# EAGLE design Buck scetch (EAGLE 9.3.2)
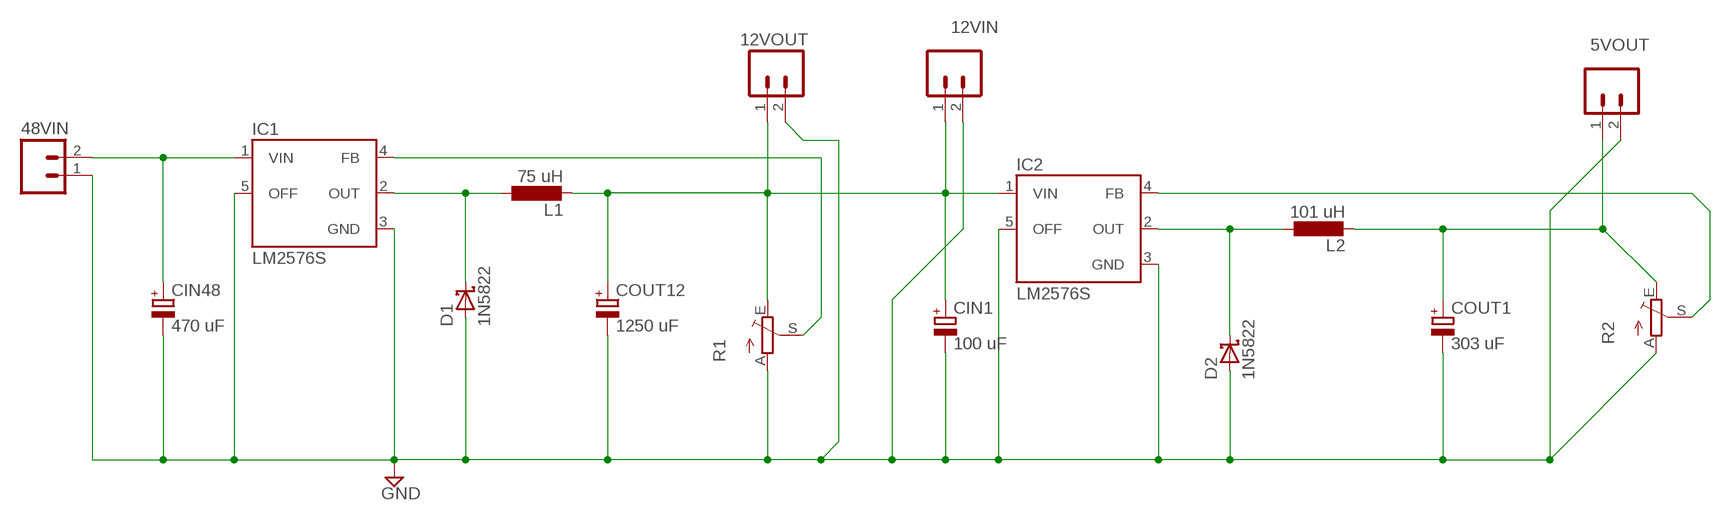
[diagram p0: schematic, sheet 1]

## Parts
5VOUT  M02  [02P]
12VIN  M02  [02P]
12VOUT  M02  [02P]
48VIN  M02  [02P]
CIN1  100 uF  CPOL-EU140CLH-0810  [140CLH-0810]
CIN48  470 uF  CPOL-EU140CLH-0810  [140CLH-0810]
COUT1  303 uF  CPOL-EU140CLH-0810  [140CLH-0810]
COUT12  1250 uF  CPOL-EU140CLH-0810  [140CLH-0810]
D1  1N5822  [DIOAD2120W130L950D530P]
D2  1N5822  [DIOAD2120W130L950D530P]
IC1  LM2576S  [TO263-5]
IC2  LM2576S  [TO263-5]
L1  75 uH  L-EUWE-TPC  [POWER-CHOKE_WE-TPC]
L2  101 uH  L-EUWE-TPC  [POWER-CHOKE_WE-TPC]
R1  0  TRIM_EU-B25P  [B25P]
R2  TRIM_EU-B25P  [B25P]

## Nets
GND: 5VOUT.2 12VIN.2 12VOUT.2 48VIN.1 CIN1.- CIN48.- COUT1.- COUT12.- D1.A D2.A IC1.3(GND) IC1.5(OFF) IC2.3(GND) IC2.5(OFF) R1.A R2.A
N$1: D1.C IC1.2(OUT) L1.1
N$2: 12VIN.1 12VOUT.1 CIN1.+ COUT12.+ IC2.1(VIN) L1.2 R1.E
N$3: IC1.4(FB) R1.S
N$4: 48VIN.2 CIN48.+ IC1.1(VIN)
N$5: D2.C IC2.2(OUT) L2.1
N$6: 5VOUT.1 COUT1.+ L2.2 R2.E
N$11: IC2.4(FB) R2.S

## Library data of the parts
5VOUT 12VIN 12VOUT 48VIN = con-amp-quick:M02: AMP QUICK CONNECTOR; OC_FARNELL: unknown; OC_NEWARK: unknown
CIN1 CIN48 COUT1 COUT12 = rcl:CPOL-EU: POLARIZED CAPACITOR, European symbol; SPICEPREFIX: C
D1 D2 = 1N5822:1N5822: 1N5822 Series 40 V 3 A Through Hole Schottky Rectifier - DO-201AD; AVAILABILITY: Unavailable; DESCRIPTION: Diode Schottky 40V 3A Through Hole DO-201AD; DIGIKEY-PURCHASE-URL: https://snapeda.com/shop?store=DigiKey&id=1356736; MF: ON Semiconductor; MP: 1N5822; PACKAGE: DO-201AD-201 Panjit; PRICE: None
IC1 IC2 = v-reg-3:LM2576: National Semiconductor <http://www.national.com> 3.0A "Simple Switcher"(c) 52kHz, Vout 1.23-37V (HV: 57V), Vin 40V (HV: 60V), 50µA standby current
L1 L2 = rcl:L-EU: INDUCTOR, European symbol; SPICEPREFIX: L
R1 R2 = pot:TRIM_EU-: POTENTIOMETER

## Board
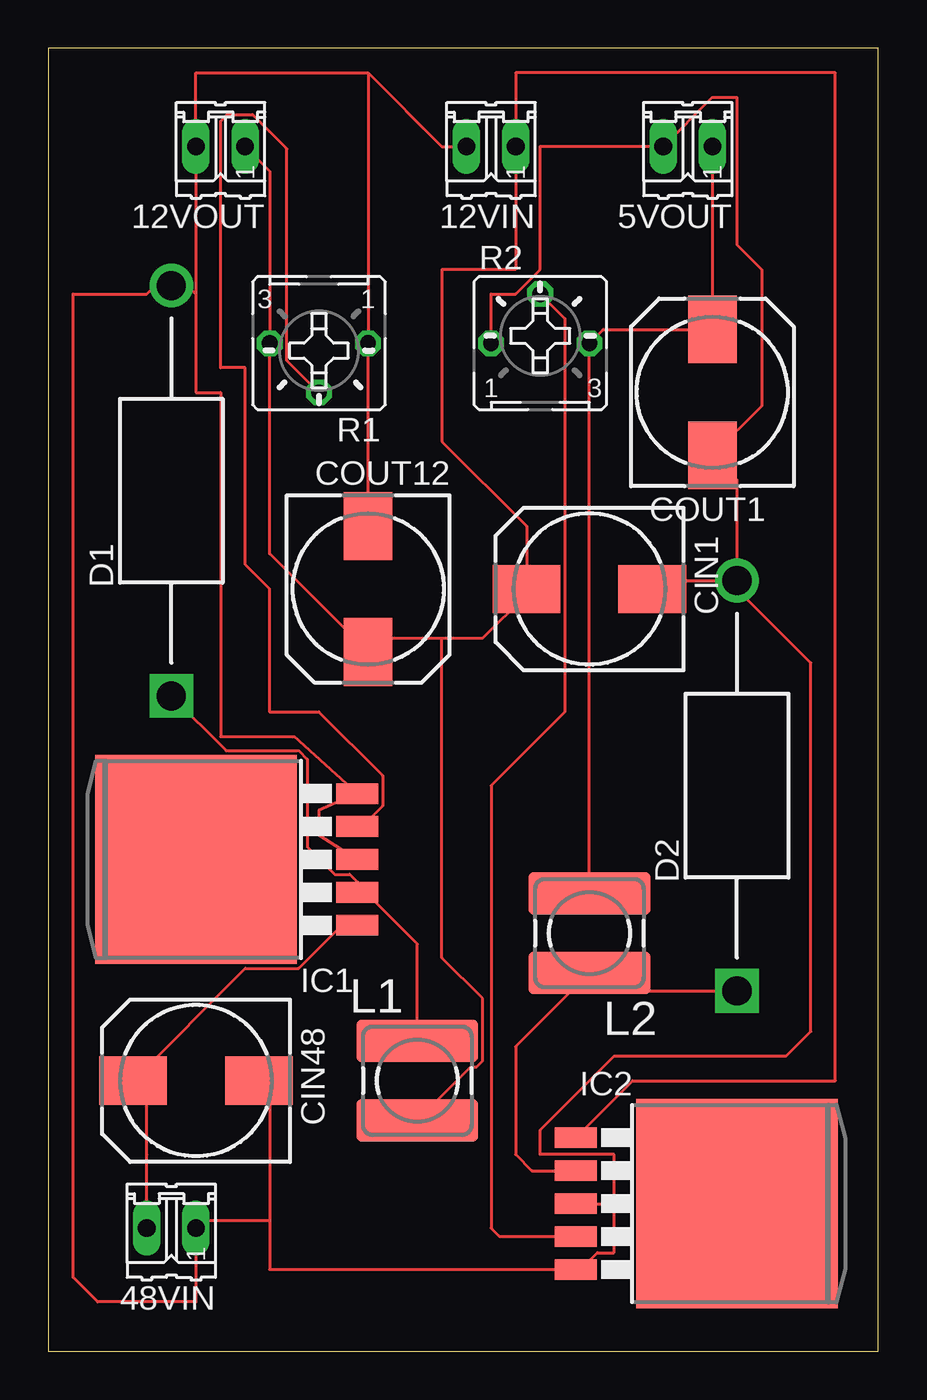
[diagram p1: board, top side]

Size 42.85 x 67.3 mm. Coordinates in mm from the lower left corner, seen from the top.
Outline: 0,0 42.85,0 42.85,67.3 0,67.3 0,0
Copper layers (1*16): Top 0.035mm / dielectric 1.5mm / Bottom 0.035mm
Design rules "default": minimum track width 6mil, minimum drill 0.35mm, track to track 6mil, track to pad 6mil, pad to pad 6mil, via to via 6mil, smd to smd 6mil, copper to edge 40mil, drill to drill 6mil, minimum pad ring 10mil, minimum via ring 8mil, stop-mask expansion 4mil, vias tented up to drill 0mil, thermal gap 10mil

### Footprints (pad centres in the part's own frame; a part is rotated, then mirrored left to right if it is on the bottom)
02P = drill 0.914 long: 1 -1.27,0; 2 1.27,0
140CLH-0810 = smd 3.5 x 2.5: + 3.25,0; - -3.25,0
DIOAD2120W130L950D530P = drill 1.5 pad 2.25: A 10.6,0 | drill 1.5 pad 2.25 square: C -10.6,0
TO263-5 = smd 1.067 x 2.159: 1 -3.404,-5.791; 2 -1.702,-5.791; 3 0,-5.791; 4 1.702,-5.791; 5 3.404,-5.791 | smd 10.8 x 10.41: 6 0,2.54
POWER-CHOKE_WE-TPC = smd 6.3 x 2.2: 1 0,2.05; 2 0,-2.05
B25P = drill 0.813 octagon: A -2.54,0; E 2.54,0; S 0,2.54

### Placement (x,y rotation side)
5VOUT  33.02,62.23 180 top
12VIN  22.86,62.23 180 top
12VOUT  8.89,62.23 180 top
48VIN  6.35,6.35 180 top
CIN1  27.94,39.37 180 top
CIN48  7.62,13.97 180 top
COUT1  34.29,49.53 90 top
COUT12  16.51,39.37 270 top
D1  6.35,44.45 90 top
D2  35.56,29.21 90 top
IC1  10.16,25.4 90 top
IC2  33.02,7.62 270 top
L1  19.05,13.97 0 top
L2  27.94,21.59 180 top
R1  13.97,52.07 180 top
R2  25.4,52.07 0 top

### Tracks (layer width: path | path; a pad name or v marks a point on that pad's centre or on a via)
GND
  Top 0.152: R2.A 22.86,54.61 24.13,54.61 25.4,55.88 25.4,62.23 5VOUT.2 34.29,64.77 35.56,64.77 35.56,57.15 36.83,55.88 36.83,48.82 COUT1.- 35.56,45.01 D2.A | IC1.3 13.97,26.67 13.97,27.94 IC1.5 12.7,31.75 8.89,31.75 8.89,49.53 7.62,49.53 7.62,54.61 | COUT12.- R1.A 16.51,66.04 | 16.51,66.04 7.62,66.04 12VOUT.2 7.62,54.61 | 16.51,66.04 20.32,62.23 12VIN.2 | 7.62,54.61 7.18,55.05 D1.A 5.52,55.05 5.08,54.61 1.27,54.61 1.27,3.81 2.54,2.54 7.62,2.54 48VIN.1 8.03,6.76 11.43,6.76 | CIN48.- 11.43,13.41 11.43,6.76 | 11.43,6.76 11.43,4.22 IC2.5 27.68,4.41 28.35,5.08 29.21,5.08 29.21,7.62 | 29.21,7.62 29.21,10.16 25.4,10.16 25.4,11.43 29.21,15.24 38.1,15.24 39.37,16.51 39.37,35.56 35.56,39.37 D2.A | CIN1.- 31.63,39.81 D2.A | IC2.3 29.21,7.62
N$1
  Top 0.152: 15.95,24.13 15.95,24.25 15.56,24.64 14.78,24.64 13.37,26.04 13.37,30.57 12.92,31.03 9.17,31.03 D1.C | 15.95,24.13 IC1.2 | L1.1 19.05,21.03 15.95,24.13
N$2
  Top 0.152: L1.2 21.82,14.69 22.13,14.69 22.43,14.99 22.43,18.21 20.32,20.32 20.32,36.83 | 12VOUT.1 11.43,60.96 R1.E 11.43,41.2 COUT12.+ 17.22,36.83 20.32,36.83 | 20.32,36.83 22.43,36.83 24.69,39.09 CIN1.+ 24.69,42.62 20.32,46.99 20.32,55.88 24.13,55.88 12VIN.1 24.13,66.04 40.64,66.04 40.64,13.97 30.18,13.97 IC2.1
N$3
  Top 0.152: R1.S 12.32,51.18 12.32,62.11 10.55,63.88 9.22,63.88 8.89,63.55 8.89,50.8 10.16,50.8 10.16,40.64 11.43,39.37 11.43,33.02 13.97,33.02 17.26,29.73 17.26,28.18 16.19,27.1 IC1.4
N$4
  Top 0.152: 48VIN.2 5.08,10.16 5.08,13.26 CIN48.+ 10.17,19.77 12.92,19.77 15.14,22 IC1.1
N$5
  Top 0.152: D2.C 28.87,18.61 arc-90 L2.1 24.13,15.73 24.13,10.16 24.97,9.32 26.67,9.32 IC2.2
N$6
  Top 0.152: L2.2 R2.E 28.65,52.78 COUT1.+ 5VOUT.1
N$11
  Top 0.152: R2.S 26.67,53.34 26.67,33.02 22.86,29.21 22.86,6.35 23.29,5.92 IC2.4